# Altium schematic sheet STM32_microcontroller_IOs.SchDoc: STM32 microcontroller I/Os
size A4; Date: Not used; ApprovedBy: Not used; CheckedBy: Not used; Author: Not used; CompanyName: STMicroelectronics; DrawnBy: Not used; Engineer: Not used; Organization: Not used; Address1: Not used; Address2: Not used; Address3: Not used; Address4: Not used; DocumentNumber: 3; Revision: Not used; SheetNumber: 3; SheetTotal: 8; CurrentTime: Not used; CurrentDate: Not used; Time: Not used; DocumentFullPathAndName: Not used; DocumentName: Not used; ModifiedDate: Not used; ImagePath: Not used; ProjectName: Not used; Application_BuildNumber: Not used
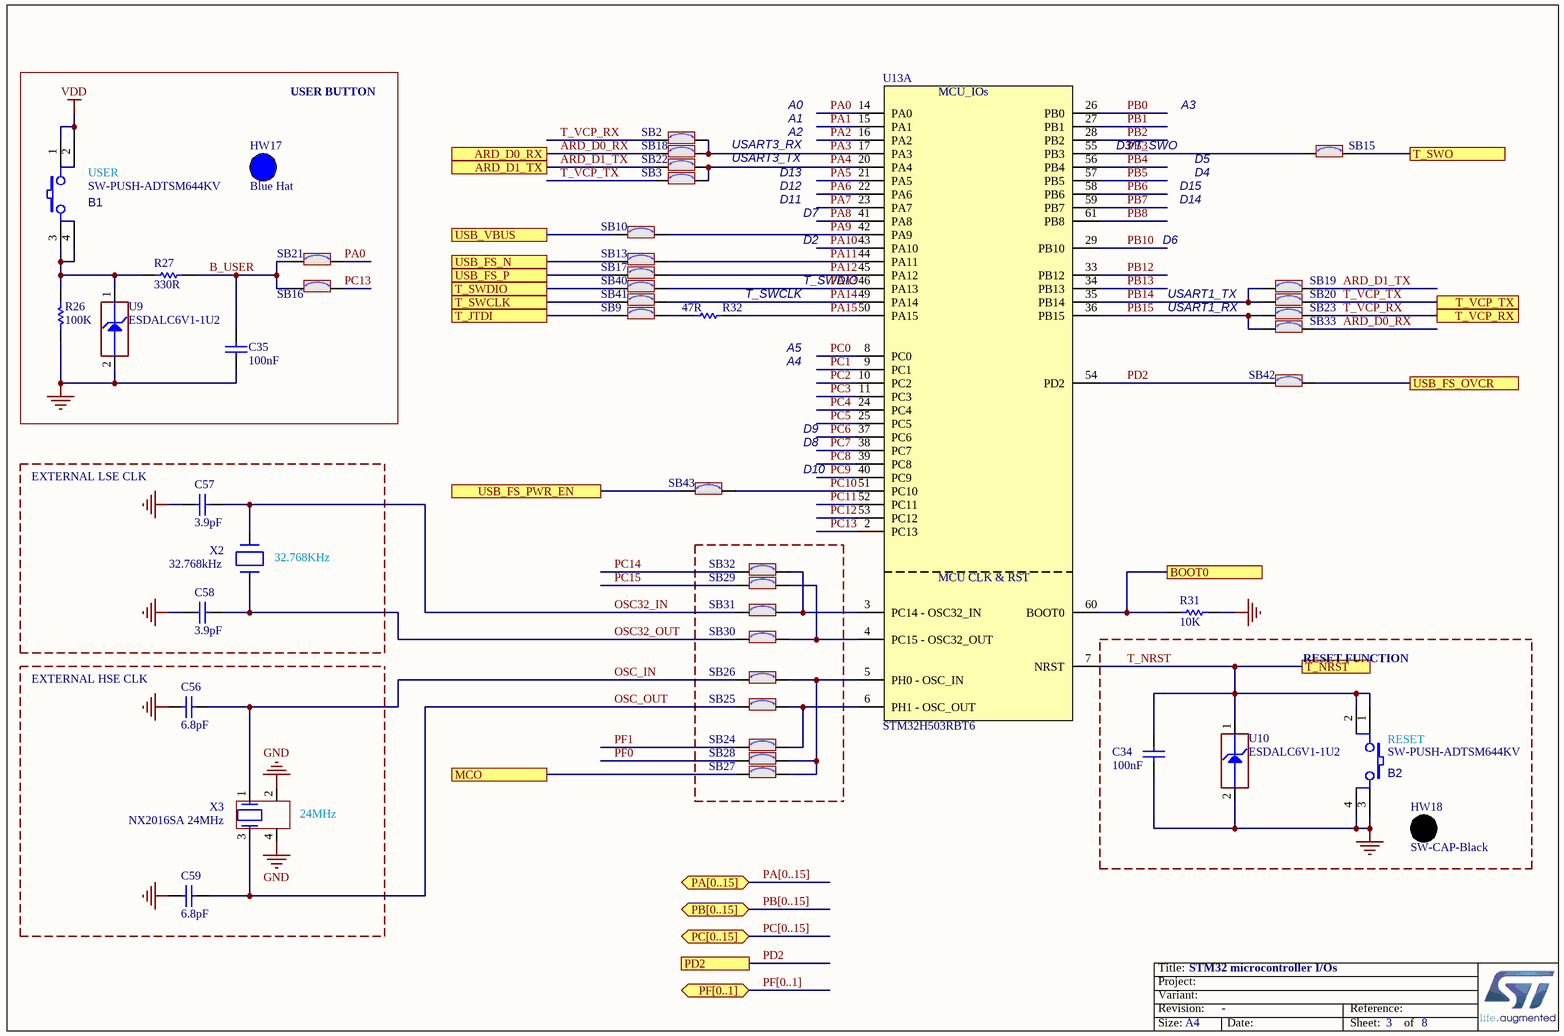
[diagram p0: STM32_microcontroller_IOs.SchDoc]

## Parts
B1  value SW-PUSH-ADTSM644KV  [SWI_APEM_ADTSM644KV_BLACK]  (hidden comment: SW_PUSH_SMD)
B2  value SW-PUSH-ADTSM644KV  [SWI_APEM_ADTSM644KV_BLACK]  (hidden comment: SW_PUSH_SMD)
C34  value 100nF  [C0402]
C35  value 100nF  [C0402]
C56  value 6.8pF  [C0402]
C57  value 3.9pF  [C0402]  (hidden comment: Capacitor)
C58  value 3.9pF  [C0402]  (hidden comment: Capacitor)
C59  value 6.8pF  [C0402]
HW17  value Blue Hat  (hidden comment: BUTTON_HAT_BLUE)  (mechanical)
HW18  SW-CAP-Black  [N/A]  (mechanical)
R26  value 100K  [R0603]
R27  value 330R  [R0603]
R31  value 10K  [R0603]
R32  value 47R  [R0402]
SB2  (no value)  [SOLDER-BRIDGE_R0603-0R]
SB3  (no value)  [SOLDER-BRIDGE_R0603-0R]
SB9  (no value)  [SOLDER-BRIDGE_R0603-0R]
SB10  (no value)  [SOLDER-BRIDGE_R0603-0R]
SB13  (no value)  [SOLDER-BRIDGE_R0603-0R]
SB15  (no value)  [SOLDER-BRIDGE_R0603-0R]
SB16  (no value)  [SOLDER-BRIDGE_R0603-0R]
SB17  (no value)  [SOLDER-BRIDGE_R0603-0R]
SB18  (no value)  [SOLDER-BRIDGE_R0603-0R]
SB19  (no value)  [SOLDER-BRIDGE_R0603-0R]
SB20  (no value)  [SOLDER-BRIDGE_R0603-0R]
SB21  (no value)  [SOLDER-BRIDGE_R0603-0R]
SB22  (no value)  [SOLDER-BRIDGE_R0603-0R]
SB23  (no value)  [SOLDER-BRIDGE_R0603-0R]
SB24  (no value)  [SOLDER-BRIDGE_R0603-0R]
SB25  (no value)  [SOLDER-BRIDGE_R0603-0R]
SB26  (no value)  [SOLDER-BRIDGE_R0603-0R]
SB27  (no value)  [SOLDER-BRIDGE_R0603-0R]
SB28  (no value)  [SOLDER-BRIDGE_R0603-0R]
SB29  (no value)  [SOLDER-BRIDGE_R0603-0R]
SB30  (no value)  [SOLDER-BRIDGE_R0603-0R]
SB31  (no value)  [SOLDER-BRIDGE_R0603-0R]
SB32  (no value)  [SOLDER-BRIDGE_R0603-0R]
SB33  (no value)  [SOLDER-BRIDGE_R0603-0R]
SB40  (no value)  [SOLDER-BRIDGE_R0603-0R]
SB41  (no value)  [SOLDER-BRIDGE_R0603-0R]
SB42  (no value)  [SOLDER-BRIDGE_R0603-0R]
SB43  (no value)  [SOLDER-BRIDGE_R0603-0R]
U9  value ESDALC6V1-1U2  [ESD_ST0201]
U10  value ESDALC6V1-1U2  [ESD_ST0201]
U13  value STM32H503RBT6  [ICC_LQFP64_10X10_P050_SOCKET_YAMAICHI_IC149-064-069-B5_NM]  (hidden comment: STM32H503RBH6)  (part A of 2)
X2  value 32.768kHz  [CRY_NX1610SE_2P]  (hidden comment: XTAL_2_PINS)
X3  value NX2016SA 24MHz  [CRY_NX2016SA_4P]

## Ports
ARD_D0_RX, ARD_D1_TX, BOOT0, MCO, PA[0..15] (bidir), PB[0..15] (bidir), PC[0..15] (bidir), PD2, PF[0..1] (bidir), T_JTDI, T_NRST, T_SWCLK, T_SWDIO, T_SWO, T_VCP_RX, T_VCP_TX, USB_FS_N, USB_FS_OVCR, USB_FS_P, USB_FS_PWR_EN, USB_VBUS

## Nets
GND: B2.3 B2.4 C34.1 C35.1 C56.1 C57.1 C58.1 C59.1 R26.1 R31.1 U9.2(GND) U10.2(GND) X3.2 X3.4
VDD: B1.1 B1.2
ARD_D0_RX: SB18.2 SB33.1 ; port ARD_D0_RX
ARD_D1_TX: SB19.1 SB22.2 ; port ARD_D1_TX
B_USER: C35.2 R27.2 SB16.1 SB21.1
BOOT0: R31.2 U13.60(BOOT0) ; port BOOT0
MCO: SB27.1 ; port MCO
OSC32_IN: C57.2 SB31.1 X2.2(X2)
OSC32_OUT: C58.2 SB30.1 X2.1(X1)
OSC_IN: C56.2 SB26.1 X3.1
OSC_OUT: C59.2 SB25.1 X3.3
PA0: SB21.2 U13.14(PA0)
PA1: U13.15(PA1)
PA2: U13.16(PA2)
PA3: SB2.1 SB18.1 U13.17(PA3)
PA4: SB3.1 SB22.1 U13.20(PA4)
PA5: U13.21(PA5)
PA6: U13.22(PA6)
PA7: U13.23(PA7)
PA8: U13.41(PA8)
PA9: SB10.2 U13.42(PA9)
PA10: U13.43(PA10)
PA11: SB13.2 U13.44(PA11)
PA12: SB17.2 U13.45(PA12)
PA13: SB40.2 U13.46(PA13)
PA14: SB41.2 U13.49(PA14)
PA15: R32.2 U13.50(PA15)
PB0: U13.26(PB0)
PB1: U13.27(PB1)
PB2: U13.28(PB2)
PB3: SB15.1 U13.55(PB3)
PB4: U13.56(PB4)
PB5: U13.57(PB5)
PB6: U13.58(PB6)
PB7: U13.59(PB7)
PB8: U13.61(PB8)
PB10: U13.29(PB10)
PB12: U13.33(PB12)
PB13: U13.34(PB13)
PB14: SB19.2 SB20.2 U13.35(PB14)
PB15: SB23.2 SB33.2 U13.36(PB15)
PC0: U13.8(PC0)
PC1: U13.9(PC1)
PC2: U13.10(PC2)
PC3: U13.11(PC3)
PC4: U13.24(PC4)
PC5: U13.25(PC5)
PC6: U13.37(PC6)
PC7: U13.38(PC7)
PC8: U13.39(PC8)
PC9: U13.40(PC9)
PC10: SB43.2 U13.51(PC10)
PC11: U13.52(PC11)
PC12: U13.53(PC12)
PC13: SB16.2 U13.2(PC13)
PC14: SB32.1
PC15: SB29.1
PD2: SB42.1 U13.54(PD2) ; port PD2
PF0: SB28.1
PF1: SB24.1
T_JTDI: SB9.1 ; port T_JTDI
T_NRST: B2.1 B2.2 C34.2 U10.1(IO1) U13.7(NRST) ; port T_NRST
T_SWCLK: SB41.1 ; port T_SWCLK
T_SWDIO: SB40.1 ; port T_SWDIO
T_SWO: SB15.2 ; port T_SWO
T_VCP_RX: SB2.2 SB23.1 ; port T_VCP_RX
T_VCP_TX: SB3.2 SB20.1 ; port T_VCP_TX
USB_FS_N: SB13.1 ; port USB_FS_N
USB_FS_OVCR: SB42.2 ; port USB_FS_OVCR
USB_FS_P: SB17.1 ; port USB_FS_P
USB_FS_PWR_EN: SB43.1 ; port USB_FS_PWR_EN
USB_VBUS: SB10.1 ; port USB_VBUS
NetB1_3: B1.3 B1.4 R26.2 R27.1 U9.1(IO1)
NetR32_1: R32.1 SB9.2
NetSB24_2: SB24.2 SB25.2 U13.6(PH1_-_OSC_OUT)
NetSB26_2: SB26.2 SB27.2 SB28.2 U13.5(PH0_-_OSC_IN)
NetSB29_2: SB29.2 SB30.2 U13.4(PC15_-_OSC32_OUT)
NetSB31_2: SB31.2 SB32.2 U13.3(PC14_-_OSC32_IN)

## Buses and harness runs
bus PA[0..15] = port PA[0..15]
bus PB[0..15] = port PB[0..15]
bus PC[0..15] = port PC[0..15]
bus PF[0..1] = port PF[0..1]

## Notes on the sheet
- USER BUTTON
- A0
- A3
- (near B1) USER
- USART3_TX
- USART3_RX
- D13
- A1
- A2
- D3/T_SWO
- D4
- D5
- D12
- D11
- D7
- D2
- D15
- D6
- D14
- (near R32) T_SWCLK
- (near R32) T_SWDIO
- USART1_RX
- USART1_TX
- A4
- A5
- D8
- D9
- EXTERNAL LSE CLK
- D10
- (near X2) 32.768KHz
- EXTERNAL HSE CLK
- RESET FUNCTION
- (near B2) RESET
- (near X3) 24MHz
- Title:
- Project:
- Size:
- Revision:
- Variant:
- -
- Date:
- Reference:
- Sheet:
- of
- (in symbol MCD-02438, part A) MCU_IOs; MCU CLK & RST

## Library data of the parts
B1 B2 = MCD-02524: Push Button, SPST-NO, 0.05A, 12V SMT, T=7.30mm, changeable caps AKTSC62x; Part_Type: Misc; Part_Preference: Recommended; Manufacturer: APEM INC; Manufacturer_Part_Number: ADTSM644SVTR; Alternate_Manufacturer: DIPTRONICS; Alternate_Manufacturer_Part_Number: DTSM644SVTR; Internal_Part_Number: MCD-02524; Status: Checked; Package: N/A; ComponentLink1URL: http://tunmcdsvn.tun.st.com/Component_Documentation_Library/Trunk/Misc/APEM_INC_ADTS_&_AKTSC_Series; Order_Code_Digikey: 679-3994-ND; Order_Code_Farnell: N/A; Order_Code_RS: N/A
C34 C35 = MCD-00102: Capacitor, MLCC, 100nF, 16V, X7R, 10%, 0402, T=0,5mm; Manufacturer_Part_Number: CC0402KRX7R7BB104; Manufacturer: YAGEO; Provided_By: Subcon; Initial_Board_Reference: MB1262; Internal_Part_Number: MCD-00102; Status: Released; Package: C0402; ComponentLink1Description: Yageo_Capacitor_X7R-series.pdf; ECCN_US: n/a; ECCN_EU: n/a; Part_Type: Capacitor; ComponentLink1URL: http://tunmcdsvn.tun.st.com/Component_Datasheet_Library/Trunk/Capacitors/Yageo_Multilayer_Capacitor_X7R_series_100pF_to_22uF
C56 C59 = MCD-00674: Capacitor, MLCC, 6.8pF, 50V, NPO, +-0.25pF, 0402, T=0.5mm; Manufacturer_Part_Number: CC0402CRNPO9BN6R8; Manufacturer: YAGEO; Provided_By: SUBCO; Internal_Part_Number: MCD-00674; Status: Released; Part_Type: Capacitor; Package: C0402; ComponentLink1Description: Datasheet; ComponentLink1URL: http://tunmcdsvn.tun.st.com/Component_Datasheet_Library/Trunk/Capacitors/Yageo_Capacitor_NP0_16V-to-50V; ECCN_US: N/A; ECCN_EU: N/A
C57 C58 = MCD-01602: Capacitor, MLCC, 3.9pF, 50V, NPO, +/-0.1pF, 0402, T=0.5mm; Part_Preference: Recommended; Manufacturer: YAGEO; Manufacturer_Part_Number: CC0402BRNPO9BN3R9; Component_Country_Of_Origin: China; ShowFields: YES; ID: 3702; Internal_Part_Number: MCD-01602; Status: Released; Part_Type: Capacitor; Package: 0402; ComponentLink1URL: http://tunmcdsvn.tun.st.com/Component_Documentation_Library/Trunk/Capacitor/YAGEO_NP0_Series; Order_Code_Digikey: 311-1622-1-ND; Order_Code_Farnell: N/A; Order_Code_RS: N/A
HW17 = MCD-02136: Switch hat, blue, For KTSC-62B; Part_Type: Misc; Part_Preference: Recommended; Manufacturer: APEM INC; Manufacturer_Part_Number: AKTSC62B; Order_Code_RS: 378-6779; Component_Country_Of_Origin: Unknown; ShowFields: YES; ID: 4236; Internal_Part_Number: MCD-02136; Status: Checked; ComponentLink1URL: http://tunmcdsvn.tun.st.com/Component_Datasheet_Library/Trunk/Mechanical/APEM_BLUEHAT_KTSC62; Order_Code_Digikey: AKTSC62B-ND; Order_Code_Farnell: N/A
HW18 = MCD-02526: Black round cap for ADTSM644KV; Part_Type: Mechanical; Part_Preference: Recommended; Manufacturer: APEM INC; Manufacturer_Part_Number: AKTSC62K; Value: SW-CAP-AKTSC62K; Order_code_Digikey: 679-2319-ND; Order_code_Farnell: N/A; Order_code_RS: N/A; Status: Checked; ComponentLink1URL: http://tunmcdsvn.tun.st.com/Component_Documentation_Library/Trunk/Misc/APEM_INC_ADTS_&_AKTSC_Series; Internal_Part_Number: MCD-02526; Alternate_Manufacturer: N/A; Alternate_Manufacturer_Part_Number: N/A; Package: N/A
R26 = MCD-00223: Resistor,100K,0603,1%,1/10W; Manufacturer_Part_Number: RC0603FR-07100KL; Manufacturer: YAGEO; Provided_By: Subcon; Initial_Board_Reference: MB1319; Internal_Part_Number: MCD-00223; ECCN_US: n/a; ECCN_EU: n/a; ComponentLink1Description: Yageo_Resistor_RC0603-series.pdf; Status: Released; Part_Type: Resistor; Package: R0603; ComponentLink1URL: http://tunmcdsvn.tun.st.com/Component_Datasheet_Library/Trunk/Resistors/Yageo_Resistor_RC0603-series
R27 = MCD-00197: Resistor,330R,0603,1%,1/10W; Manufacturer_Part_Number: RC0603FR-07330RL; Manufacturer: YAGEO; Provided_By: Subcon; Internal_Part_Number: MCD-00197; Status: Released; ComponentLink1Description: Yageo_Resistor_RC0603-series.pdf; ECCN_US: n/a; ECCN_EU: n/a; Part_Type: Resistor; Package: R0603; ComponentLink1URL: http://tunmcdsvn.tun.st.com/Component_Datasheet_Library/Trunk/Resistors/Yageo_Resistor_RC0603-series
R31 = MCD-00220: Resistor,10K,0603,1%,1/10W; Manufacturer_Part_Number: RC0603FR-0710KL; Manufacturer: YAGEO; Provided_By: Subcon; Initial_Board_Reference: MB1319; Internal_Part_Number: MCD-00220; ECCN_US: n/a; ECCN_EU: n/a; ComponentLink1Description: Yageo_Resistor_RC0603-series.pdf; Status: Released; Part_Type: Resistor; Package: R0603; ComponentLink1URL: http://tunmcdsvn.tun.st.com/Component_Datasheet_Library/Trunk/Resistors/Yageo_Resistor_RC0603-series
R32 = MCD-00481: Resistor,47R,0402,1%,1/16W; Manufacturer_Part_Number: RC0402FR-0747RL; Manufacturer: YAGEO; Provided_By: SUBCO; ECCN_US: EAR99; ECCN_EU: NEC; Internal_Part_Number: MCD-00481; Status: Released; Part_Type: Resistor; Package: R0402; ComponentLink1Description: Datasheet; ComponentLink1URL: http://tunmcdsvn.tun.st.com/Component_Datasheet_Library/Trunk/Resistors/Yageo_Resistor_RC0402-series
SB2 SB3 SB9 SB10 SB13 SB15-SB33 SB40-SB43 = MCD-00071: Solder Bridge ON; Part_Type: Mechanical; Manufacturer_Part_Number: RC0603JR-070RL; Manufacturer: YAGEO; Provided_By: SUBCO; Internal_Part_Number: MCD-00071; ECCN_US: n/a; ECCN_EU: n/a; Status: Released; Package: SB0603; ComponentLink1Description: Datasheet; ComponentLink1URL: http://tunmcdsvn.tun.st.com/Component_Datasheet_Library/Trunk/Resistors/Yageo_Resistor_RC0603-series
U9 U10 = MCD-00170: ESD protection 6V1; Part_Type: Diode; Manufacturer: STMICROELECTRONICS; ECCN_US: EAR99; ECCN_EU: NEC; Provided_By: Subcon; Initial_Board_Reference: MB1274; Internal_Part_Number: MCD-00170; Status: Released; Manufacturer_Part_Number: ESDALC6V1-1U2; ComponentLink1Description: STM_ESD_ESDALC6V1-1U2.pdf; ComponentLink1URL: http://tunmcdsvn.tun.st.com/Component_Datasheet_Library/Trunk/Diodes/STM_ESD_ESDALC6V1-1U2
U13 = MCD-02438: MCU, Arm Cortex-M33, 250MHz, 32-bit MCU, 128KB flash, 32KB SRAM; Part_Type: IC; Part_Preference: Recommended; Manufacturer: STMICROELECTRONICS; ShowFields: YES; ID: 4544; Internal_Part_Number: MCD-02438; Status: New; Manufacturer_Part_Number: STM32H503RBT6; Package: LQFP64; ComponentLink1URL: http://tunmcdsvn.tun.st.com/Component_Documentation_Library/Trunk/IC/STMICROELECTRONICS_STM32H503RBH6; Order_Code_Digikey: N/A; Order_Code_Farnell: N/A; Order_Code_RS: N/A
X2 = MCD-02291: Crystal, 32.768kHz, 9pF, +/-20ppm, 70KR, 1.6x1mm; Part_Type: Crystal_Osc; Part_Preference: Recommended; Manufacturer: NDK; Manufacturer_Part_Number: NX1610SE-32.768KHZ-EXS00A-MU01499; Component_Country_Of_Origin: Unknown; ShowFields: YES; ID: 4391; Internal_Part_Number: MCD-02291; Status: Released; Package: 1.6x1mm; ComponentLink1URL: http://tunmcdsvn.tun.st.com/Component_Datasheet_Library/Trunk/Crystal_Osc/NDK_NX1610SE 32.768KHz EXS00A-MU01499; Order_Code_Digikey: N/A; Order_Code_Farnell: N/A; Order_Code_RS: N/A
X3 = MCD-01036: Crystal 24MHz, 6pF, +-20ppm, 80ohms max, SMD; Part_Type: Crystal_Osc; Manufacturer_Part_Number: NX2016SA 24MHz EXS00A-CS10820; Manufacturer: NDK; BMS_Part_Number: 9157045; ECCN_US: EAR99; ECCN_EU: NEC; Provided_By: SUBCO; Internal_Part_Number: MCD-01036; Status: Released; Package: (2016) 2.0 x 1.6 x 0.45 mm; ComponentLink1Description: Datasheet; ComponentLink1URL: http://tunmcdsvn.tun.st.com/Component_Datasheet_Library/Trunk/Crystal_Osc/NDK_NX2016SA 24MHz EXS00A-CS10820 (EXS10B-27366B); Order_Code_Digikey: 644-1365